# EAGLE schematic fp (EAGLE 6.5.0)
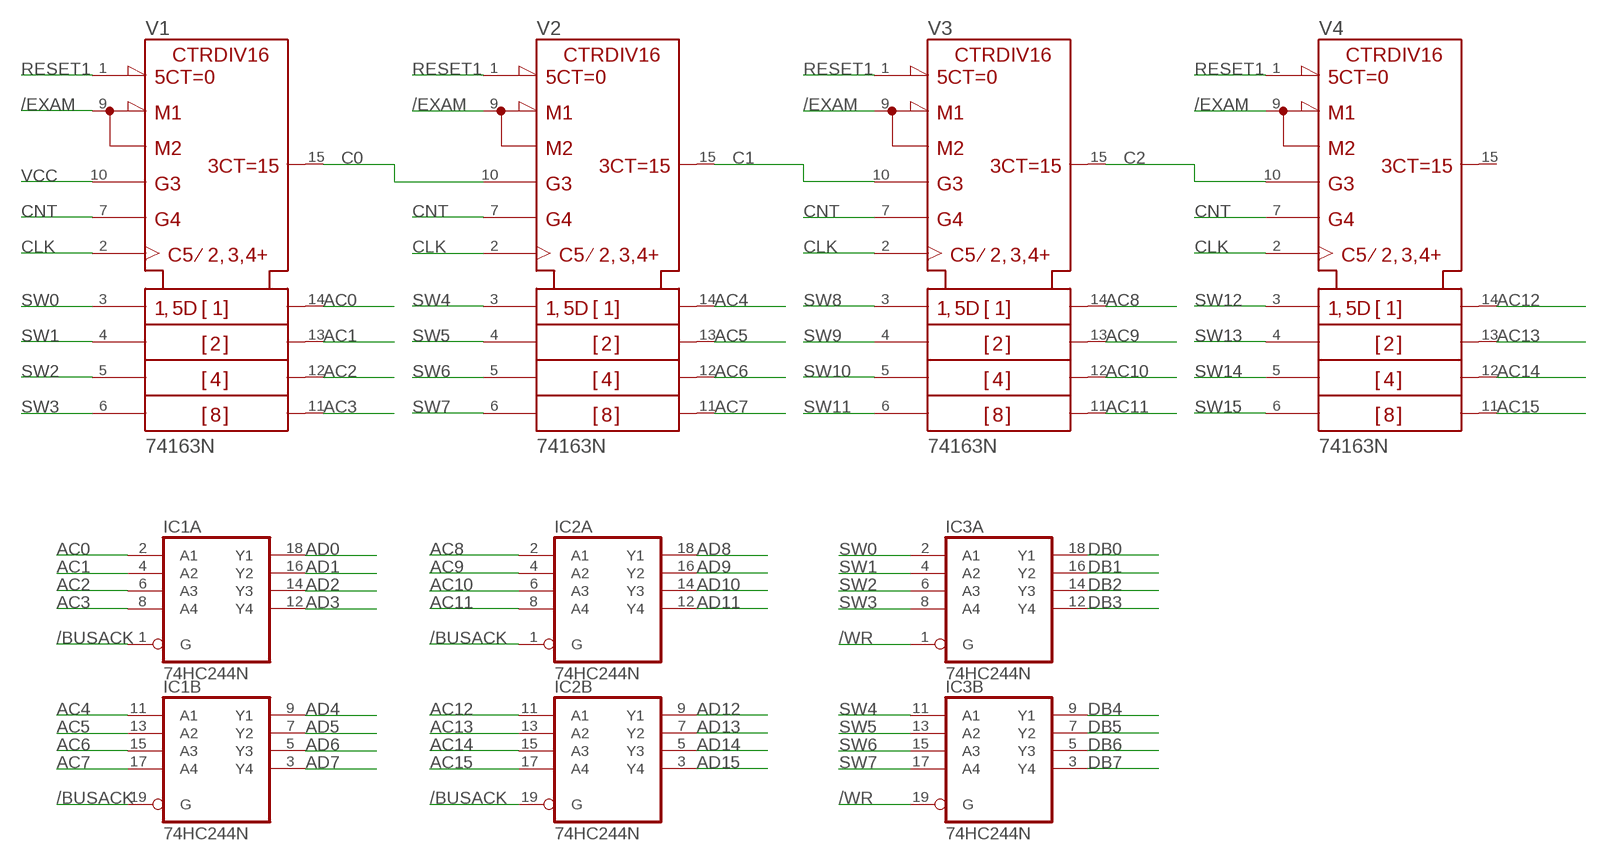
[diagram p0: schematic, sheet 1]

## Parts
IC1  74HC244N  [DIL20]
IC2  74HC244N  [DIL20]
IC3  74HC244N  [DIL20]
V1  74163N  [DIL16]
V2  74163N  [DIL16]
V3  74163N  [DIL16]
V4  74163N  [DIL16]

## Nets
/BUSACK: IC1.1(A:G) IC1.19(B:G) IC2.1(A:G) IC2.19(B:G)
/EXAM: V1.9(!LOAD) V2.9(!LOAD) V3.9(!LOAD) V4.9(!LOAD)
/WR: IC3.1(A:G) IC3.19(B:G)
AC0: IC1.2(A:A1) V1.14(QA)
AC1: IC1.4(A:A2) V1.13(QB)
AC2: IC1.6(A:A3) V1.12(QC)
AC3: IC1.8(A:A4) V1.11(QD)
AC4: IC1.11(B:A1) V2.14(QA)
AC5: IC1.13(B:A2) V2.13(QB)
AC6: IC1.15(B:A3) V2.12(QC)
AC7: IC1.17(B:A4) V2.11(QD)
AC8: IC2.2(A:A1) V3.14(QA)
AC9: IC2.4(A:A2) V3.13(QB)
AC10: IC2.6(A:A3) V3.12(QC)
AC11: IC2.8(A:A4) V3.11(QD)
AC12: IC2.11(B:A1) V4.14(QA)
AC13: IC2.13(B:A2) V4.13(QB)
AC14: IC2.15(B:A3) V4.12(QC)
AC15: IC2.17(B:A4) V4.11(QD)
AD0: IC1.18(A:Y1)
AD1: IC1.16(A:Y2)
AD2: IC1.14(A:Y3)
AD3: IC1.12(A:Y4)
AD4: IC1.9(B:Y1)
AD5: IC1.7(B:Y2)
AD6: IC1.5(B:Y3)
AD7: IC1.3(B:Y4)
AD8: IC2.18(A:Y1)
AD9: IC2.16(A:Y2)
AD10: IC2.14(A:Y3)
AD11: IC2.12(A:Y4)
AD12: IC2.9(B:Y1)
AD13: IC2.7(B:Y2)
AD14: IC2.5(B:Y3)
AD15: IC2.3(B:Y4)
C0: V1.15(RCO) V2.10(ENT)
C1: V2.15(RCO) V3.10(ENT)
C2: V3.15(RCO) V4.10(ENT)
CLK: V1.2(CLK) V2.2(CLK) V3.2(CLK) V4.2(CLK)
CNT: V1.7(ENP) V2.7(ENP) V3.7(ENP) V4.7(ENP)
DB0: IC3.18(A:Y1)
DB1: IC3.16(A:Y2)
DB2: IC3.14(A:Y3)
DB3: IC3.12(A:Y4)
DB4: IC3.9(B:Y1)
DB5: IC3.7(B:Y2)
DB6: IC3.5(B:Y3)
DB7: IC3.3(B:Y4)
RESET1: V1.1(!CLR) V2.1(!CLR) V3.1(!CLR) V4.1(!CLR)
SW0: IC3.2(A:A1) V1.3(A)
SW1: IC3.4(A:A2) V1.4(B)
SW2: IC3.6(A:A3) V1.5(C)
SW3: IC3.8(A:A4) V1.6(D)
SW4: IC3.11(B:A1) V2.3(A)
SW5: IC3.13(B:A2) V2.4(B)
SW6: IC3.15(B:A3) V2.5(C)
SW7: IC3.17(B:A4) V2.6(D)
SW8: V3.3(A)
SW9: V3.4(B)
SW10: V3.5(C)
SW11: V3.6(D)
SW12: V4.3(A)
SW13: V4.4(B)
SW14: V4.5(C)
SW15: V4.6(D)
VCC: V1.10(ENT)
Unconnected: V4.15(RCO)

## Power pins joined to a net without a drawn wire
+UB: V1.16(+UB) V2.16(+UB) V3.16(+UB) V4.16(+UB)
-UB: V1.8(-UB) V2.8(-UB) V3.8(-UB) V4.8(-UB)
GND: IC1.10(P:GND) IC2.10(P:GND) IC3.10(P:GND)
VCC: IC1.20(P:VCC) IC2.20(P:VCC) IC3.20(P:VCC)

## Library data of the parts
IC1-IC3 = 74xx-eu:74*244: Octal BUFFER and LINE DRIVER, 3-state
V1-V4 = 74ttl-din:74*163: Synchrounus 4-bit COUNTER